# Altium schematic sheet 0017_Processor - MISC.SchDoc
size A3
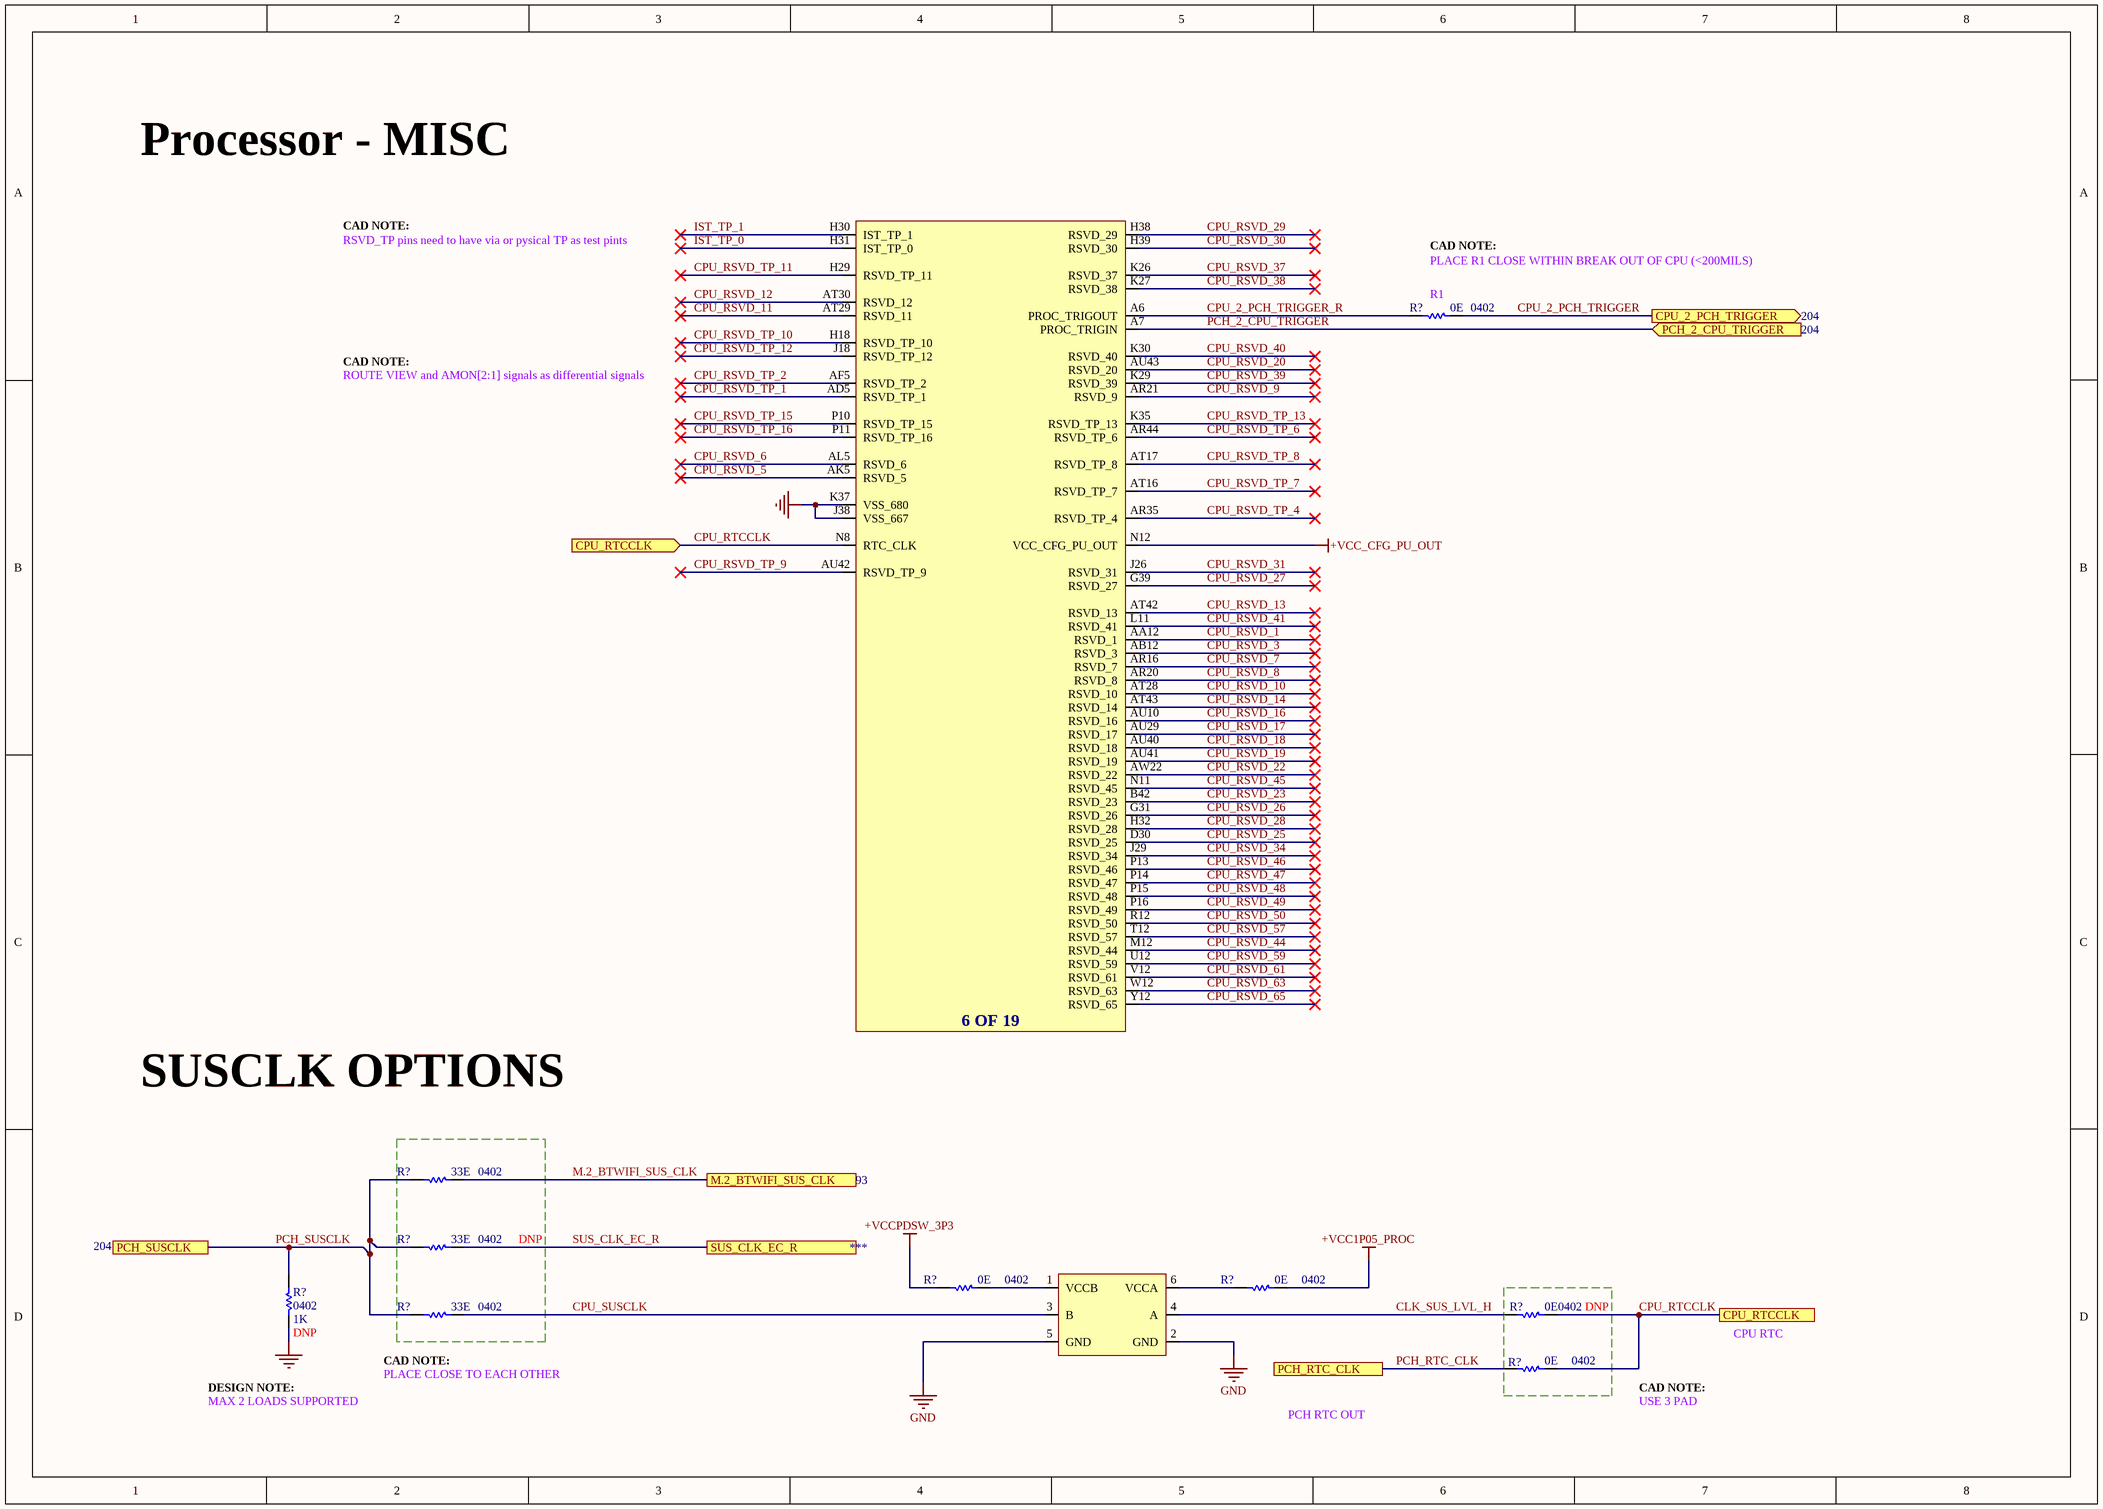
[diagram p0: 0017_Processor - MISC.SchDoc]

## Parts
(Parts that share a designator on the sheet are numbered #1, #2 ... from top to bottom, then left to right.)
R?#1  value 0E  Case/Package: 0402  [RESC0402]  (hidden comment: Res)
R?#2  value 33E  Case/Package: 0402  [RESC0402]  (hidden comment: Res)
R?#3  value 33E  Case/Package: 0402  [RESC0402]  (hidden comment: Res)
R?#4  value 0E  Case/Package: 0402  [RESC0402]  (hidden comment: Res)
R?#5  value 0E  Case/Package: 0402  [RESC0402]  (hidden comment: Res)
R?#6  value 1K  Case/Package: 0402  [RESC0402]  (hidden comment: Res)
R?#7  value 33E  Case/Package: 0402  [RESC0402]  (hidden comment: Res)
R?#8  value 0E  Case/Package: 0402  [RESC0402]  (hidden comment: Res)
R?#9  value 0E  Case/Package: 0402  [RESC0402]  (hidden comment: Res)
U?#1  C_RPL_HX_EXT  (value not drawn)  (part F of 19)
U?#2  TTL1T45  (value not drawn)

## Ports
CPU_2_PCH_TRIGGER (out), CPU_RTCCLK, CPU_RTCCLK (in), M.2_BTWIFI_SUS_CLK, PCH_2_CPU_TRIGGER (in), PCH_RTC_CLK, PCH_SUSCLK, SUS_CLK_EC_R

## Nets
+VCC1P05_PROC: R?#5.2
+VCC_CFG_PU_OUT: U?#1.N12(VCC_CFG_PU_OUT)
+VCCPDSW_3P3: R?#4.1
GND: R?#6.1 U?#1.J38(VSS_667) U?#1.K37(VSS_680) U?#2.2(GND) U?#2.5(GND)
CLK_SUS_LVL_H: R?#8.1 U?#2.4(A)
CPU_2_PCH_TRIGGER: R?#1.2 ; port CPU_2_PCH_TRIGGER
CPU_2_PCH_TRIGGER_R: R?#1.1 U?#1.A6(PROC_TRIGOUT)
CPU_RSVD_1: U?#1.AA12(RSVD_1)
CPU_RSVD_3: U?#1.AB12(RSVD_3)
CPU_RSVD_5: U?#1.AK5(RSVD_5)
CPU_RSVD_6: U?#1.AL5(RSVD_6)
CPU_RSVD_7: U?#1.AR16(RSVD_7)
CPU_RSVD_8: U?#1.AR20(RSVD_8)
CPU_RSVD_9: U?#1.AR21(RSVD_9)
CPU_RSVD_10: U?#1.AT28(RSVD_10)
CPU_RSVD_11: U?#1.AT29(RSVD_11)
CPU_RSVD_12: U?#1.AT30(RSVD_12)
CPU_RSVD_13: U?#1.AT42(RSVD_13)
CPU_RSVD_14: U?#1.AT43(RSVD_14)
CPU_RSVD_16: U?#1.AU10(RSVD_16)
CPU_RSVD_17: U?#1.AU29(RSVD_17)
CPU_RSVD_18: U?#1.AU40(RSVD_18)
CPU_RSVD_19: U?#1.AU41(RSVD_19)
CPU_RSVD_20: U?#1.AU43(RSVD_20)
CPU_RSVD_22: U?#1.AW22(RSVD_22)
CPU_RSVD_23: U?#1.B42(RSVD_23)
CPU_RSVD_25: U?#1.D30(RSVD_25)
CPU_RSVD_26: U?#1.G31(RSVD_26)
CPU_RSVD_27: U?#1.G39(RSVD_27)
CPU_RSVD_28: U?#1.H32(RSVD_28)
CPU_RSVD_29: U?#1.H38(RSVD_29)
CPU_RSVD_30: U?#1.H39(RSVD_30)
CPU_RSVD_31: U?#1.J26(RSVD_31)
CPU_RSVD_34: U?#1.J29(RSVD_34)
CPU_RSVD_37: U?#1.K26(RSVD_37)
CPU_RSVD_38: U?#1.K27(RSVD_38)
CPU_RSVD_39: U?#1.K29(RSVD_39)
CPU_RSVD_40: U?#1.K30(RSVD_40)
CPU_RSVD_41: U?#1.L11(RSVD_41)
CPU_RSVD_44: U?#1.M12(RSVD_44)
CPU_RSVD_45: U?#1.N11(RSVD_45)
CPU_RSVD_46: U?#1.P13(RSVD_46)
CPU_RSVD_47: U?#1.P14(RSVD_47)
CPU_RSVD_48: U?#1.P15(RSVD_48)
CPU_RSVD_49: U?#1.P16(RSVD_49)
CPU_RSVD_50: U?#1.R12(RSVD_50)
CPU_RSVD_57: U?#1.T12(RSVD_57)
CPU_RSVD_59: U?#1.U12(RSVD_59)
CPU_RSVD_61: U?#1.V12(RSVD_61)
CPU_RSVD_63: U?#1.W12(RSVD_63)
CPU_RSVD_65: U?#1.Y12(RSVD_65)
CPU_RSVD_TP_1: U?#1.AD5(RSVD_TP_1)
CPU_RSVD_TP_2: U?#1.AF5(RSVD_TP_2)
CPU_RSVD_TP_4: U?#1.AR35(RSVD_TP_4)
CPU_RSVD_TP_6: U?#1.AR44(RSVD_TP_6)
CPU_RSVD_TP_7: U?#1.AT16(RSVD_TP_7)
CPU_RSVD_TP_8: U?#1.AT17(RSVD_TP_8)
CPU_RSVD_TP_9: U?#1.AU42(RSVD_TP_9)
CPU_RSVD_TP_10: U?#1.H18(RSVD_TP_10)
CPU_RSVD_TP_11: U?#1.H29(RSVD_TP_11)
CPU_RSVD_TP_12: U?#1.J18(RSVD_TP_12)
CPU_RSVD_TP_13: U?#1.K35(RSVD_TP_13)
CPU_RSVD_TP_15: U?#1.P10(RSVD_TP_15)
CPU_RSVD_TP_16: U?#1.P11(RSVD_TP_16)
CPU_RTCCLK: R?#8.2 R?#9.2 U?#1.N8(RTC_CLK) ; port CPU_RTCCLK
CPU_SUSCLK: R?#7.2 U?#2.3(B)
IST_TP_0: U?#1.H31(IST_TP_0)
IST_TP_1: U?#1.H30(IST_TP_1)
M.2_BTWIFI_SUS_CLK: R?#2.2 ; port M.2_BTWIFI_SUS_CLK
PCH_2_CPU_TRIGGER: U?#1.A7(PROC_TRIGIN) ; port PCH_2_CPU_TRIGGER
PCH_RTC_CLK: R?#9.1 ; port PCH_RTC_CLK
PCH_SUSCLK: R?#2.1 R?#3.1 R?#6.2 R?#7.1 ; port PCH_SUSCLK
SUS_CLK_EC_R: R?#3.2 ; port SUS_CLK_EC_R
NetR?#4_2: R?#4.2 U?#2.1(VCCB)
NetR?#5_1: R?#5.1 U?#2.6(VCCA)

## Notes on the sheet
- Processor - MISC
- CAD NOTE:
- RSVD_TP pins need to have via or pysical TP as test pints
- (near R?#1) PLACE R1 CLOSE WITHIN BREAK OUT OF CPU (<200MILS)
- (near R?#1) R1
- ROUTE VIEW and AMON[2:1] signals as differential signals
- SUSCLK OPTIONS
- DESIGN NOTE:
- (near R?#7) CAD NOTE:
- PLACE CLOSE TO EACH OTHER
- CPU RTC
- MAX 2 LOADS SUPPORTED
- PCH RTC OUT
- USE 3 PAD
- (in symbol C_RPL_HX_EXT, part F) 6 OF 19

## Library data of the parts
R?#1 R?#4 R?#5 R?#8 R?#9 = Res: Thick Film Resistor -  0ohm, 1%, 0402
  R?#8 R?#9: DNP: DNP
R?#2 R?#3 R?#7 = Res: Thick Film Resistor -  33ohm, 1%, 0402
  R?#3: DNP: DNP
R?#6 = Res: Thick Film Resistor -  1Kohm, 1%, 0402; DNP: DNP
U?#2 = TTL1T45: CDS_LMAN_SYM_OUTLINE: -200,100,200,-100; OriginalSymbolOrigin: (-225,100); PACK_TYPE: ?